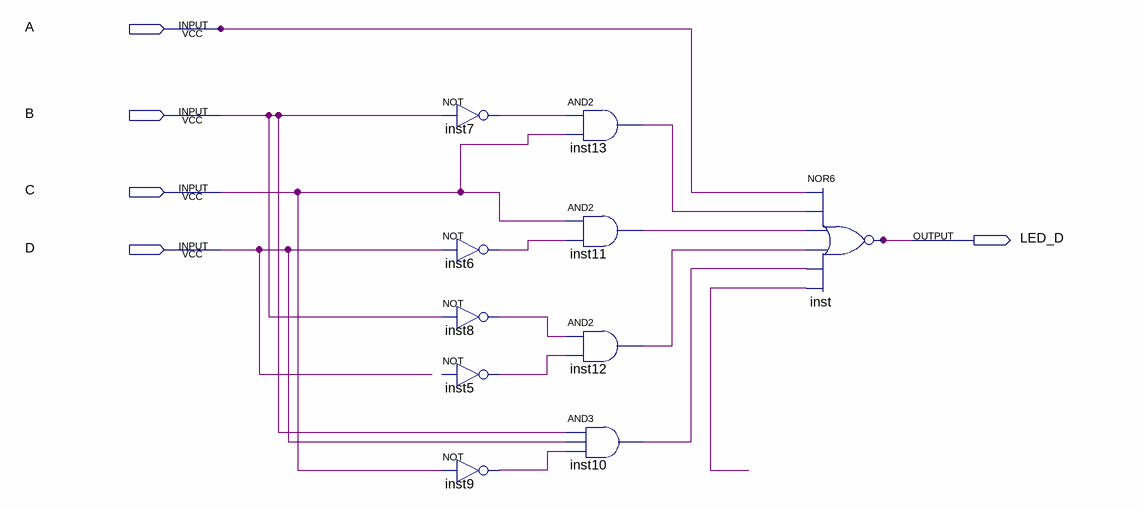
[diagram p0: schematic sheet]
// Quartus schematic led_d.bdf as structural Verilog: 10 symbols, 5 pins
module led_d (
  input  A,
  input  B,
  input  C,
  input  D,
  output LED_D
);

  wire inst5_out, inst6_out, inst7_out, inst8_out, inst9_out, inst10_out, inst11_out, inst12_out, inst13_out,
       undriven;

  not inst7 (inst7_out, B);
  not inst6 (inst6_out, D);
  not inst8 (inst8_out, B);
  // NOT inst5 has open pins: IN=open, OUT=inst5_out
  not inst9 (inst9_out, C);
  and inst13 (inst13_out, inst7_out, C);
  and inst11 (inst11_out, C, inst6_out);
  and inst12 (inst12_out, inst8_out, inst5_out);
  and inst10 (inst10_out, B, D, inst9_out);
  nor inst (LED_D, A, inst13_out, inst11_out, inst12_out, inst10_out, undriven);
endmodule
